# Altium schematic sheet GSM.SchDoc
size A4; SheetNumber: 3; SheetTotal: 12
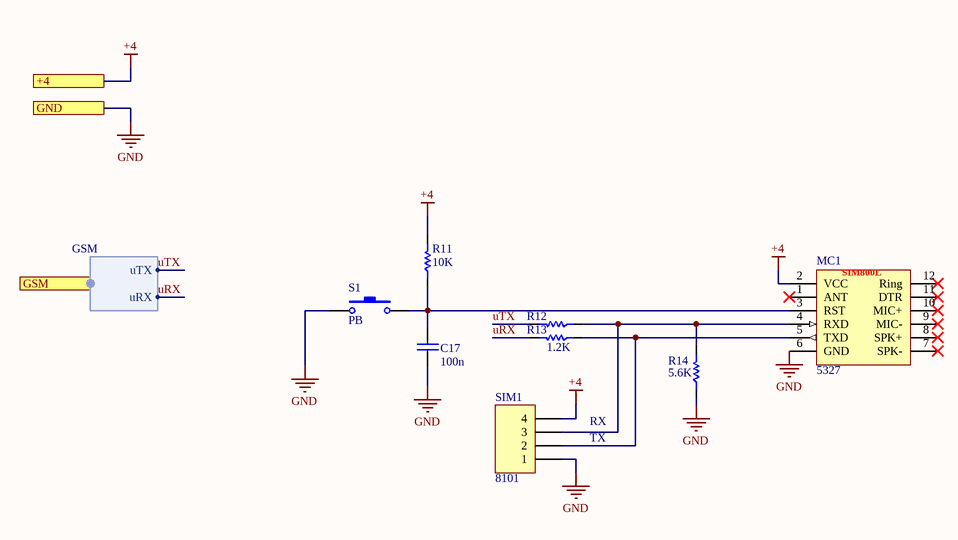
[diagram p0: GSM.SchDoc]

## Parts
C17  100n  [CAP 1206/3216]
MC1  Inflow: 5327  [Sim800L_Module]  (hidden comment: Sim800L)
R11  10K  [RES 1206 (3216X08L)]
R12  47K  [RES 1206 (3216X08L)]  (value not drawn)
R13  value 1.2K  [RES 1206 (3216X08L)]  (hidden comment: 1K)
R14  5.6K  [RES 1206 (3216X08L)]
S1  PB  [SW_PB_SMD_2PIN_SPST_6X3X2]
SIM1  Inflow: 8101  [HDR_THT_4F_2.54mm]  (hidden comment: 4)

## Ports
+4, GND, GSM (harness GSM)

## Harnesses
GSM: uTX, uRX

## Nets
+4: MC1.2(VCC) R11.2 SIM1.4 ; port +4
GND: C17.2 MC1.6(GND) R14.1 S1.2 SIM1.1 ; port GND
uRX: R13.2 ; port GSM.uRX
uTX: R12.2 ; port GSM.uTX
NetC17_1: C17.1 MC1.3(RST) R11.1 S1.1
NetMC1_4: MC1.4(RXD) R12.1 R14.2 SIM1.3
NetMC1_5: MC1.5(TXD) R13.1 SIM1.2

Not connected (* = marked no-connect by the designer): MC1 1(ANT)* 7(SPK-)* 8(SPK+)* 9(MIC-)* 10(MIC+)* 11(DTR)* 12(Ring)*

## Notes on the sheet
- RX
- TX
- (in symbol ModSen_Com_Sim800L) SIM800L

## Library data of the parts
C17 = Cap_Multi_SMD_100nF_1206: Bipolar ceramic capacitor SMD; Type: MultiLayer; Inflow: inflow?; Rating: 50V; Validation: Valid; Package: 1206; Value: 100n
MC1 = ModSen_Com_Sim800L: SimCom GSM/GPRS Module; Rating: Rating?; Validation: NT; Value: Sim800L; Package: Dip; Type: GSM-GPRS
R11-R14 = Res_SMD_1206: Resistor; Inflow: inflow?; Rating: 0.25W; Validation: Valid; Package: 1206; Type: 10%
  R11: Value: 10K
  R12: Value: 47K
  R14: Value: 5.6K
S1 = SW_PushButton_2_SMD: SMT Tactile ‎Switch; Rating: 2b; Validation: Valid; Inflow: 8260; Type: Vertical; Package: SMD; Value: PB
SIM1 = Con_FPH_4x1_V_THT_2.54: Header, single row, 4 pin; Rating: Rating?; Validation: NT; Value: 4; Package: Package?; Type: Type?